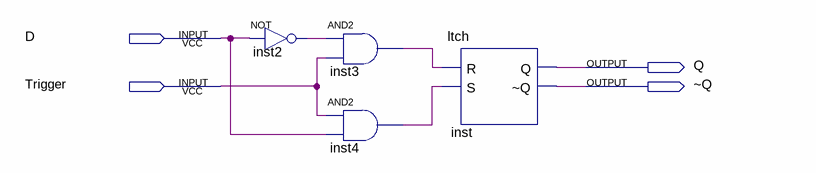
[diagram p0: schematic sheet]
// Quartus schematic ltchd.bdf as structural Verilog: 4 symbols, 4 pins
module ltchd (
  input  D,
  input  Trigger,
  output Q,
  output \~Q 
);

  wire inst2_out, inst3_out, inst4_out;

  not inst2 (inst2_out, D);
  and inst3 (inst3_out, inst2_out, Trigger);
  and inst4 (inst4_out, Trigger, D);
  ltch inst (.R(inst3_out), .S(inst4_out), .Q(Q), .\~Q (\~Q ));
endmodule
